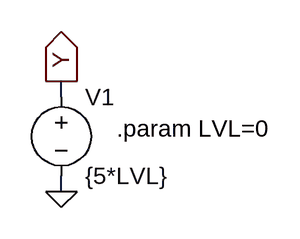
[diagram p0: schematic VTTL.asc]
VTTL.asc, the LTspice schematic file:
Version 4
SHEET 1 880 680
WIRE 192 80 192 64
WIRE 192 176 192 160
FLAG 192 176 0
FLAG 192 64 Y
IOPIN 192 64 Out
SYMBOL voltage 192 64 R0
SYMATTR InstName V1
SYMATTR Value {5*LVL}
TEXT 248 112 Left 2 !.param LVL=0

The netlist it stands for:
* VTTL.asc
V1 Y 0 {5*LVL}
.param LVL=0
.backanno
.end